# Altium schematic sheet Core_Board_FPGA_STM32.SchDoc
size A0
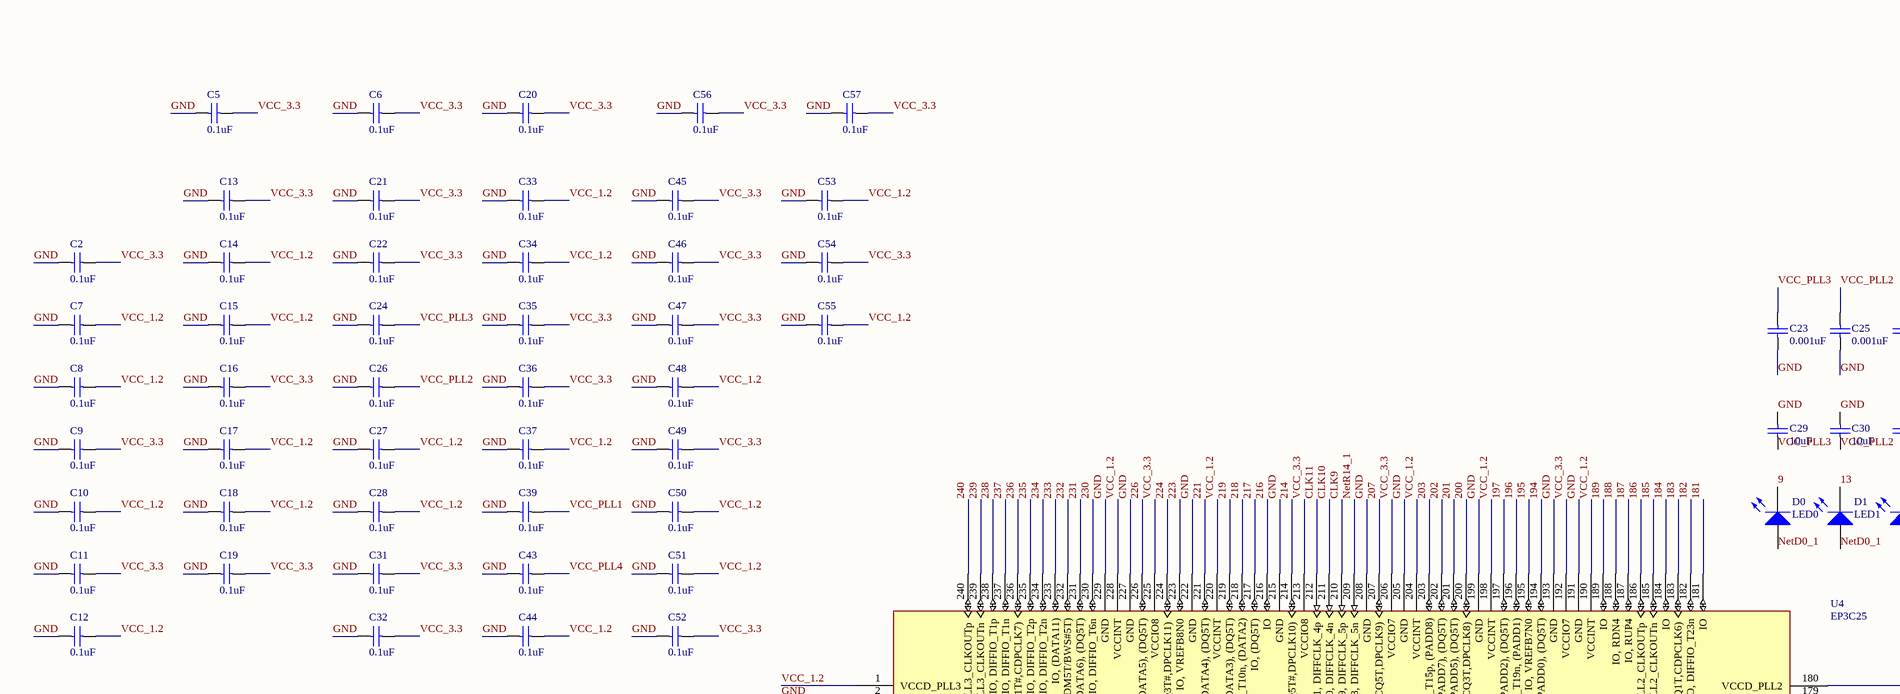
[diagram p0: Core_Board_FPGA_STM32.SchDoc, top left]
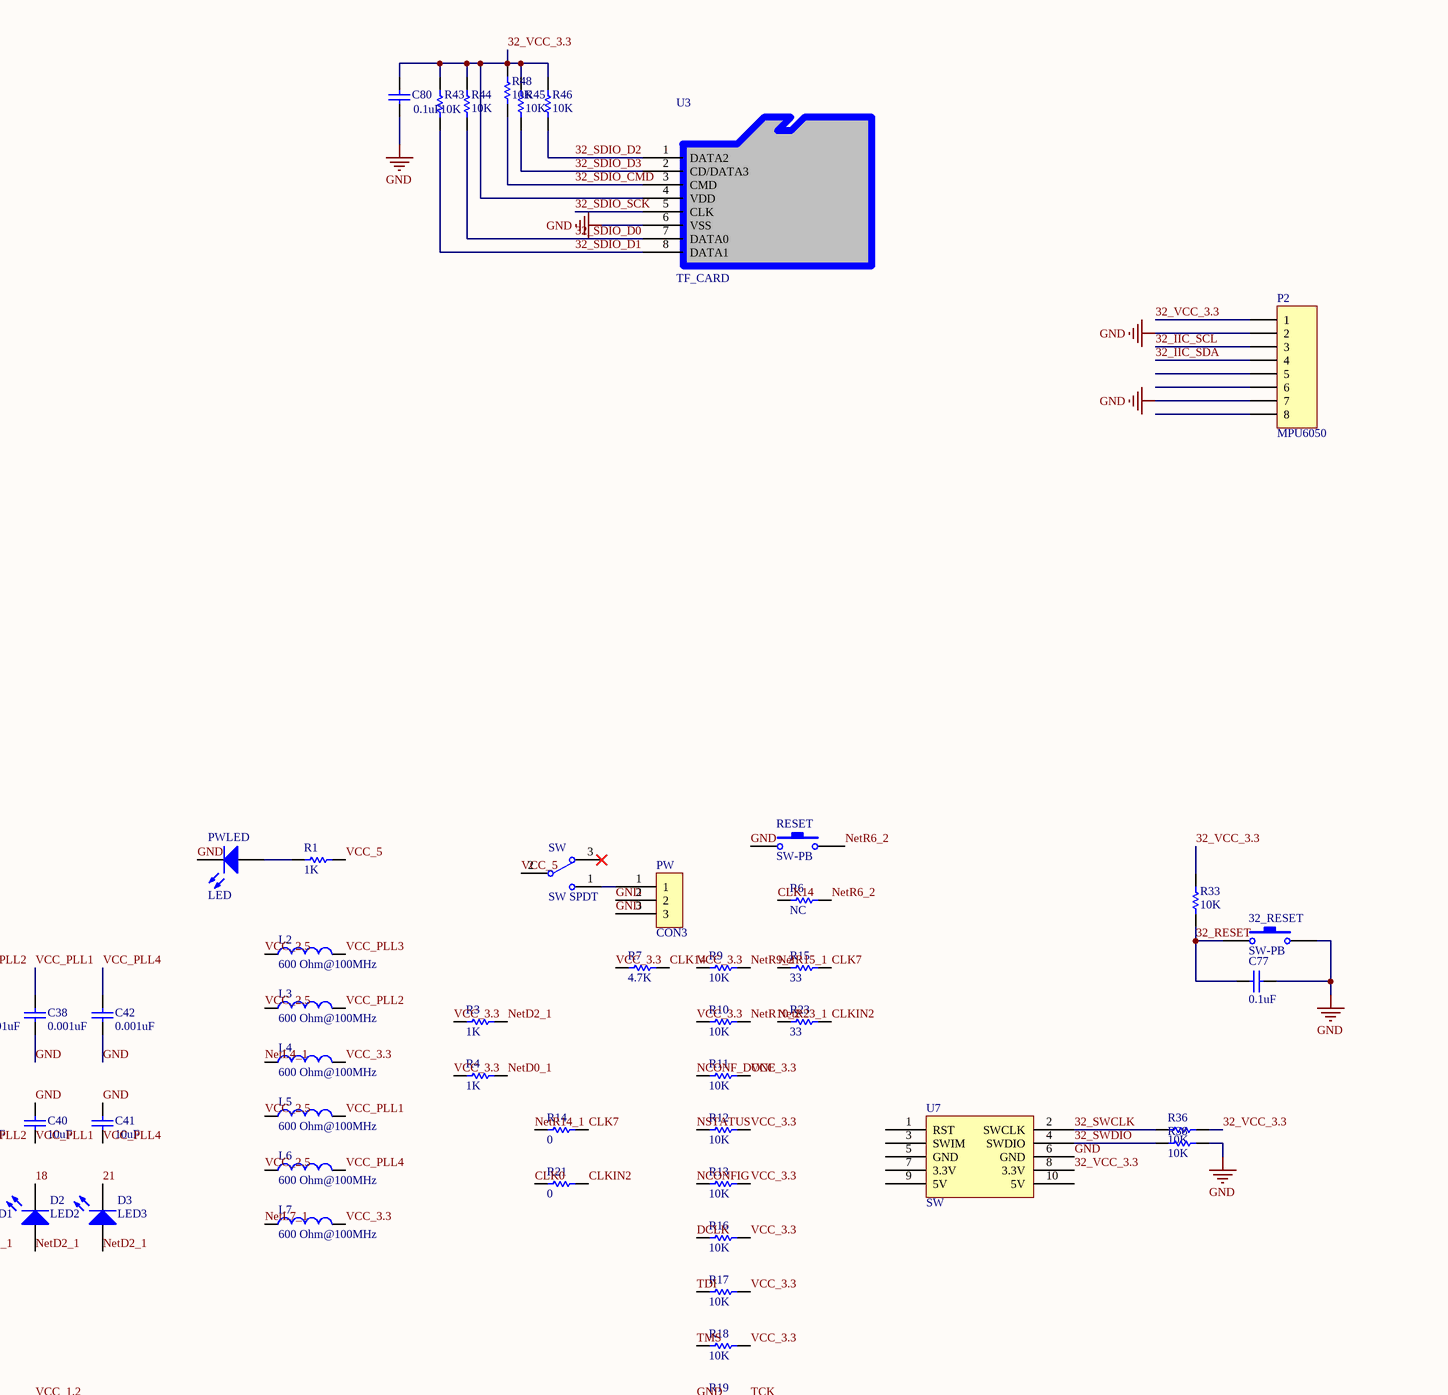
[diagram p1: Core_Board_FPGA_STM32.SchDoc, top middle]
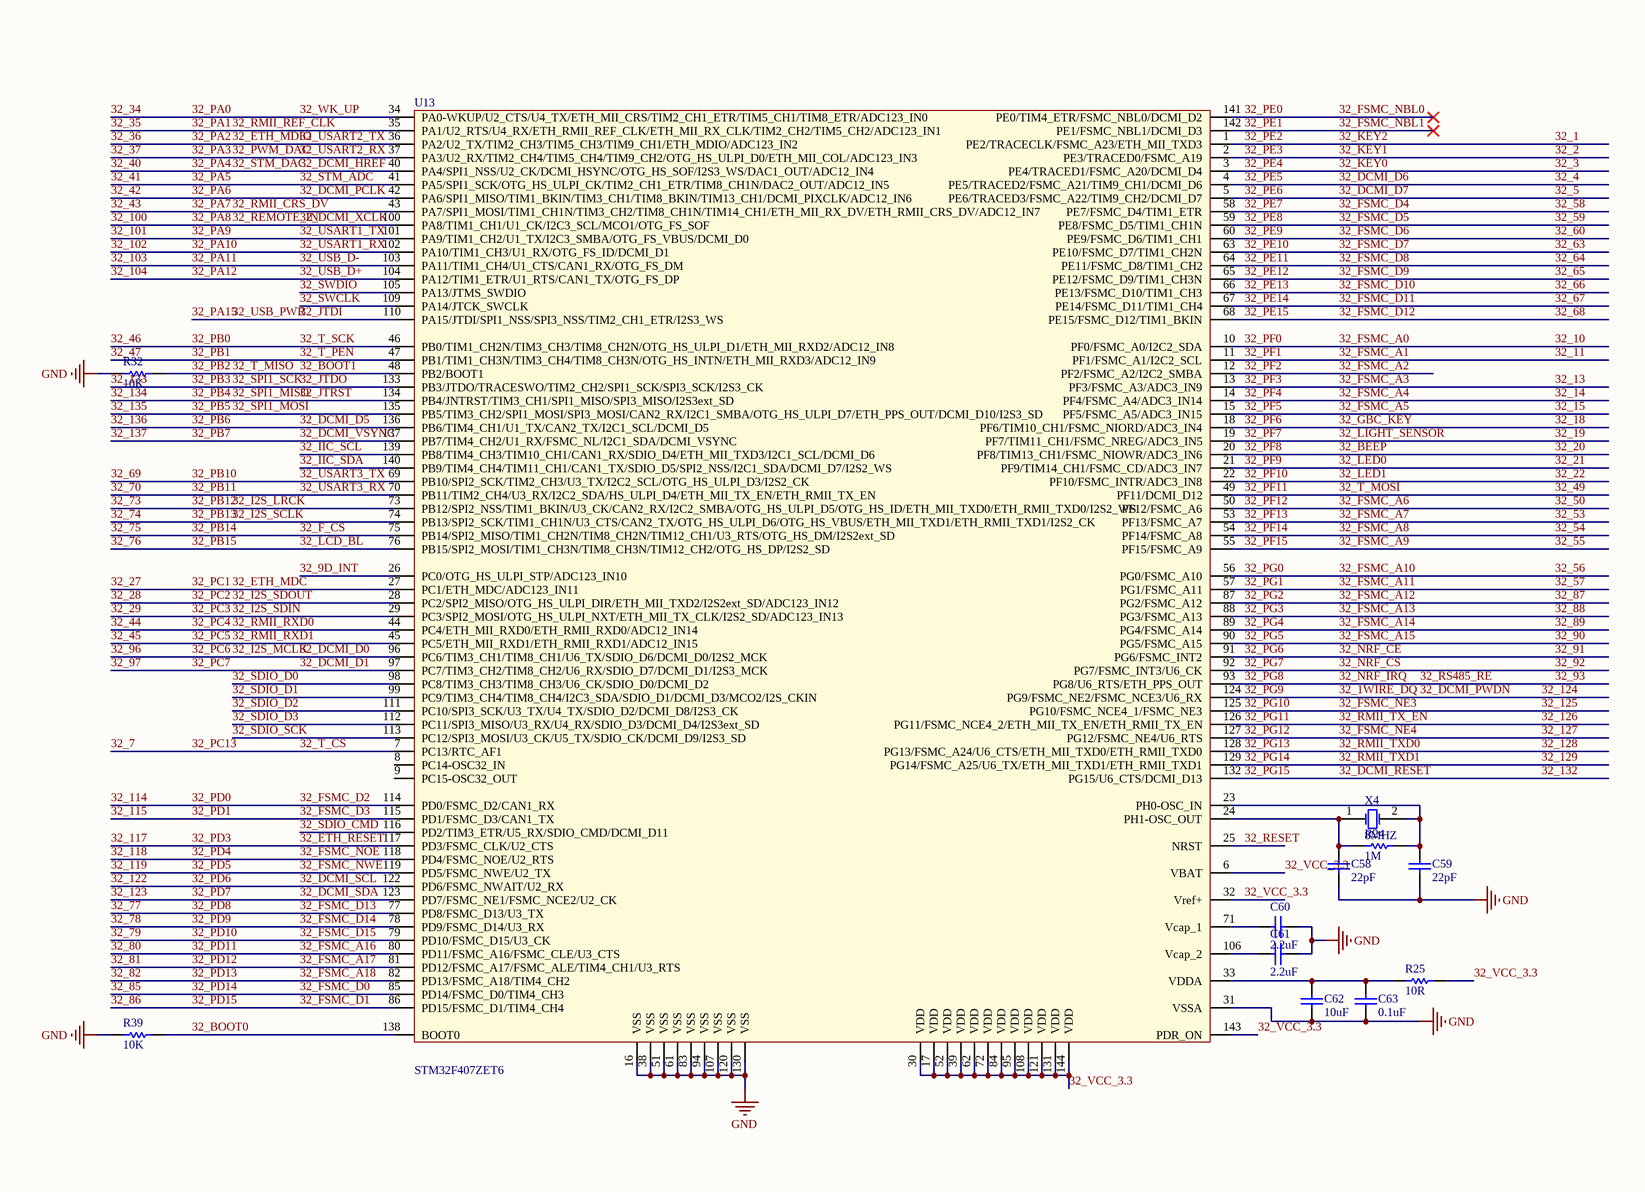
[diagram p2: Core_Board_FPGA_STM32.SchDoc, top right]
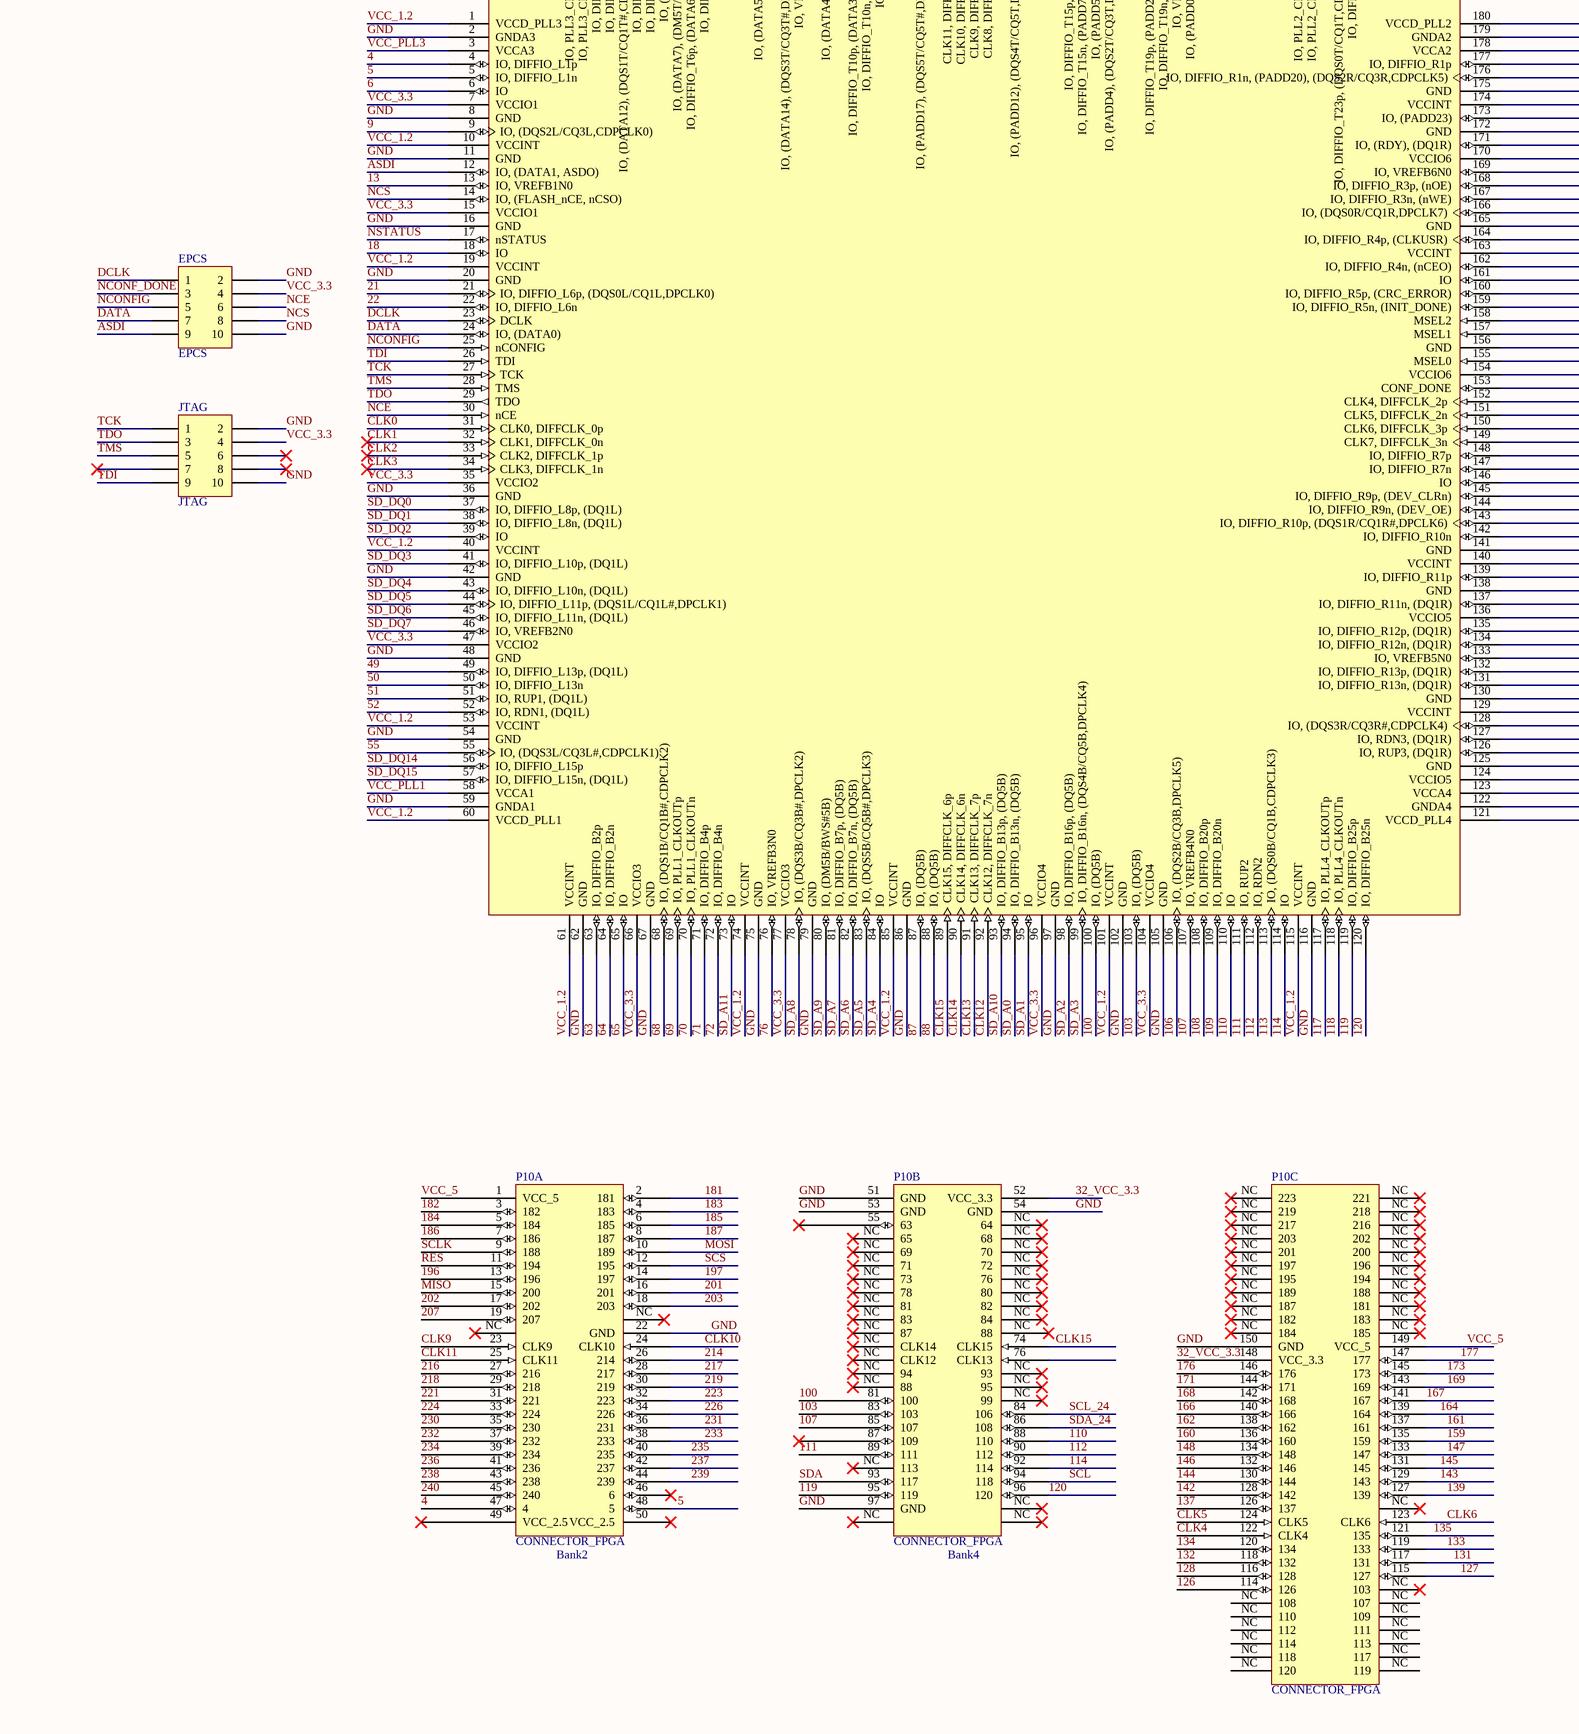
[diagram p3: Core_Board_FPGA_STM32.SchDoc, bottom left]
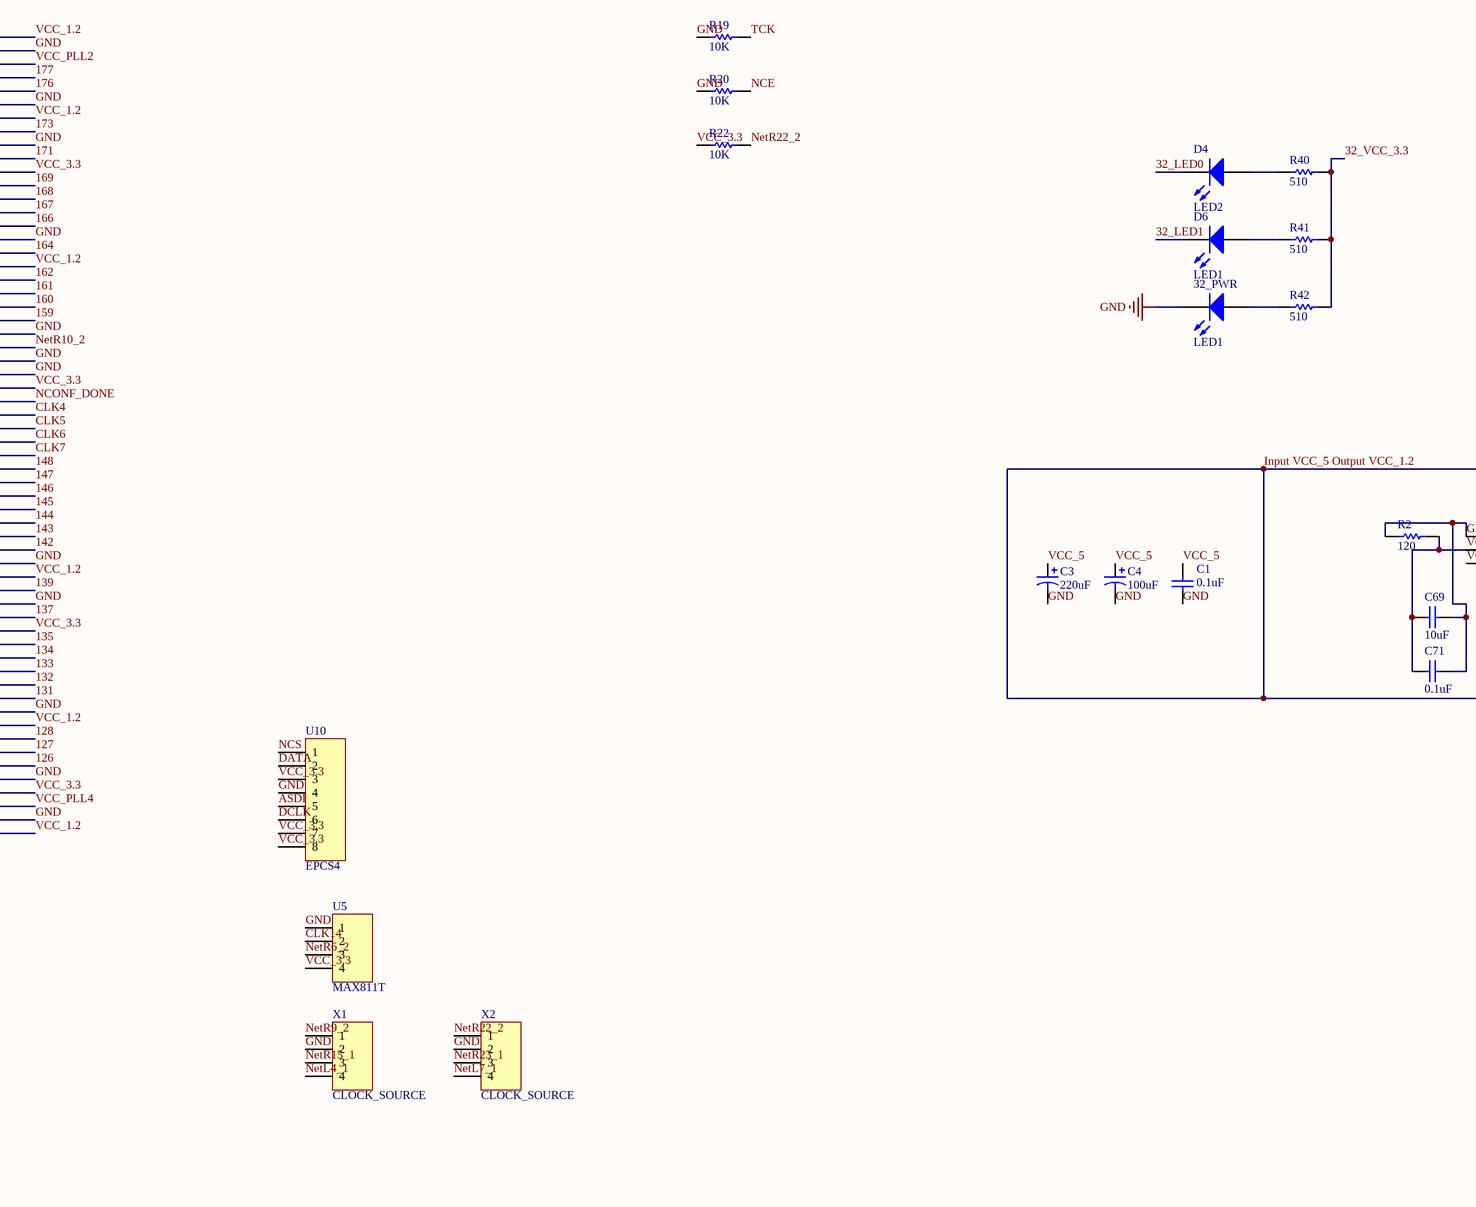
[diagram p4: Core_Board_FPGA_STM32.SchDoc, bottom middle]
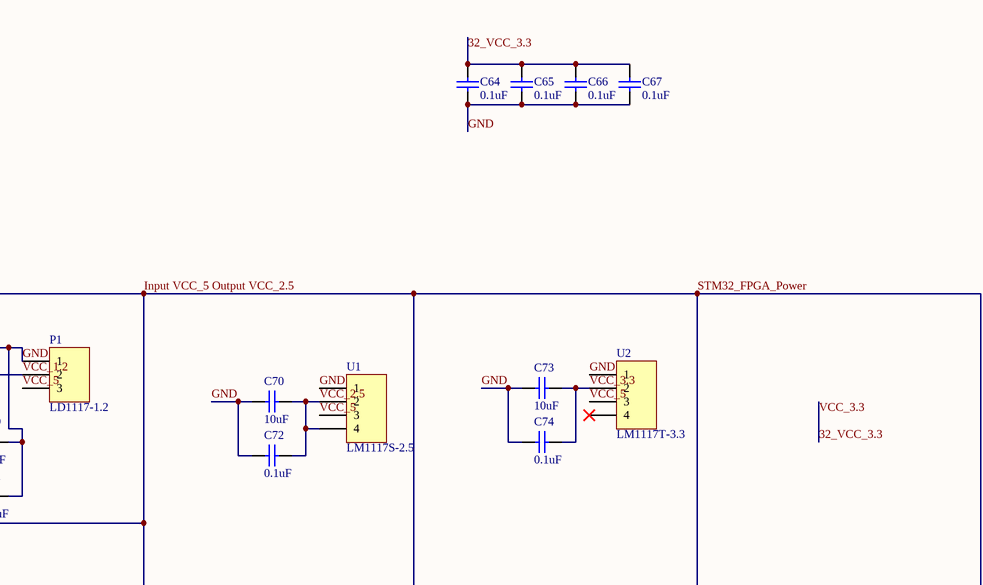
[diagram p5: Core_Board_FPGA_STM32.SchDoc, bottom right]

## Parts
32_PWR  LED1  [0805D]
32_RESET  SW-PB  [SMD_SWITH]
C1  0.1uF  [0805C]
C2  0.1uF  [0805C]
C3  220uF  [Cap6.6*6.6]
C4  100uF  [Cap6.6*6.6]
C5  0.1uF  [0805C]
C6  0.1uF  [0805C]
C7  0.1uF  [0805C]
C8  0.1uF  [0805C]
C9  0.1uF  [0805C]
C10  0.1uF  [0805C]
C11  0.1uF  [0805C]
C12  0.1uF  [0805C]
C13  0.1uF  [0805C]
C14  0.1uF  [0805C]
C15  0.1uF  [0805C]
C16  0.1uF  [0805C]
C17  0.1uF  [0805C]
C18  0.1uF  [0805C]
C19  0.1uF  [0805C]
C20  0.1uF  [0805C]
C21  0.1uF  [0805C]
C22  0.1uF  [0805C]
C23  0.001uF  [0805C]
C24  0.1uF  [0805C]
C25  0.001uF  [0805C]
C26  0.1uF  [0805C]
C27  0.1uF  [0805C]
C28  0.1uF  [0805C]
C29  10uF  [0805C]
C30  10uF  [0805C]
C31  0.1uF  [0805C]
C32  0.1uF  [0805C]
C33  0.1uF  [0805C]
C34  0.1uF  [0805C]
C35  0.1uF  [0805C]
C36  0.1uF  [0805C]
C37  0.1uF  [0805C]
C38  0.001uF  [0805C]
C39  0.1uF  [0805C]
C40  10uF  [0805C]
C41  10uF  [0805C]
C42  0.001uF  [0805C]
C43  0.1uF  [0805C]
C44  0.1uF  [0805C]
C45  0.1uF  [0805C]
C46  0.1uF  [0805C]
C47  0.1uF  [0805C]
C48  0.1uF  [0805C]
C49  0.1uF  [0805C]
C50  0.1uF  [0805C]
C51  0.1uF  [0805C]
C52  0.1uF  [0805C]
C53  0.1uF  [0805C]
C54  0.1uF  [0805C]
C55  0.1uF  [0805C]
C56  0.1uF  [0805C]
C57  0.1uF  [0805C]
C58  22pF  [0805C]
C59  22pF  [0805C]
C60  2.2uF  [0805C]
C61  2.2uF  [0805C]
C62  10uF  [0805C]
C63  0.1uF  [0805C]
C64  0.1uF  [0805C]
C65  0.1uF  [0805C]
C66  0.1uF  [0805C]
C67  0.1uF  [0805C]
C69  10uF  [0805C]
C70  10uF  [0805C]
C71  0.1uF  [0805C]
C72  0.1uF  [0805C]
C73  10uF  [0805C]
C74  0.1uF  [0805C]
C77  0.1uF  [0805C]
C80  0.1uF  [0805C]
D0  LED0  [0805D]
D1  LED1  [0805D]
D2  LED2  [0805D]
D3  LED3  [0805D]
D4  LED2  [0805D]
D6  LED1  [0805D]
EPCS  EPCS  [IDC10_S]
JTAG  JTAG  [IDC10_S]
L2  600 Ohm@100MHz  [0805R]
L3  600 Ohm@100MHz  [0805R]
L4  600 Ohm@100MHz  [0805R]
L5  600 Ohm@100MHz  [0805R]
L6  600 Ohm@100MHz  [0805R]
L7  600 Ohm@100MHz  [0805R]
P1  LD1117-1.2  [TO-252]
P2  MPU6050  [HDR1X8]
P10  CONNECTOR_FPGA  [CONNECTOR_FPGA]  (parts A,B,C of 3)
PW  CON3  [PW_PORT]
PWLED  LED  [0805D]
R1  1K  [0805R]
R2  120  [0805R]
R3  1K  [0805R]
R4  1K  [0805R]
R6  NC  [0805R]
R7  4.7K  [0805R]
R9  10K  [0805R]
R10  10K  [0805R]
R11  10K  [0805R]
R12  10K  [0805R]
R13  10K  [0805R]
R14  0  [0805R]
R15  33  [0805R]
R16  10K  [0805R]
R17  10K  [0805R]
R18  10K  [0805R]
R19  10K  [0805R]
R20  10K  [0805R]
R21  0  [0805R]
R22  10K  [0805R]
R23  33  [0805R]
R24  1M  [0805R]
R25  10R  [0805R]
R32  10K  [0805R]
R33  10K  [0805R]
R36  10K  [0805R]
R38  10K  [0805R]
R39  10K  [0805R]
R40  510  [0805R]
R41  510  [0805R]
R42  510  [0805R]
R43  10K  [1608[0603R]]
R44  10K  [1608[0603R]]
R45  10K  [1608[0603R]]
R46  10K  [1608[0603R]]
R48  10K  [1608[0603R]]
RESET  SW-PB  [SMD_SWITH]
SW  SW SPDT  [PW_SW]
U1  LM1117S-2.5  [SOT-223]
U2  LM1117T-3.3  [TO-252]
U3  TF_CARD  [TF-2]
U4  EP3C25  [PQFP240]
U5  MAX811T  [SOT143]
U7  SW  [SW_PORT]
U10  EPCS4  [SO-G8]
U13  STM32F407ZET6  [LQFP144]
X1  CLOCK_SOURCE  [CRYSTAL4]
X2  CLOCK_SOURCE  [CRYSTAL4]
X4  8MHZ  [5032]

## Nets
GND: 32_PWR.2(K) 32_RESET.2 C1.1 C2.1 C3.2 C4.2 C5.1 C6.1 C7.1 C8.1 C9.1 C10.1 C11.1 C12.1 C13.1 C14.1 C15.1 C16.1 C17.1 C18.1 C19.1 C20.1 C21.1 C22.1 C23.1 C24.1 C25.1 C26.1 C27.1 C28.1 C29.2 C30.2 C31.1 C32.1 C33.1 C34.1 C35.1 C36.1 C37.1 C38.1 C39.1 C40.2 C41.2 C42.1 C43.1 C44.1 C45.1 C46.1 C47.1 C48.1 C49.1 C50.1 C51.1 C52.1 C53.1 C54.1 C55.1 C56.1 C57.1 C58.1 C59.1 C60.2 C61.2 C62.1 C63.1 C64.1 C65.1 C66.1 C67.1 C69.1 C70.1 C71.1 C72.2 C73.1 C74.2 C77.1 C80.1 EPCS.2 EPCS.10 JTAG.2 JTAG.10 P1.1 P2.2 P2.7 P10.22(GND) P10.51(GND) P10.53(GND) P10.54(GND) P10.97(GND) P10.150(GND) PW.2 PW.3 PWLED.2(K) R2.1 R19.1 R20.1 R32.2 R38.1 R39.2 RESET.1 U1.1 U2.1 U3.6(VSS) U4.2(GNDA3) U4.8(GND) U4.11(GND) U4.16(GND) U4.20(GND) U4.36(GND) U4.42(GND) U4.48(GND) U4.54(GND) U4.59(GNDA1) U4.62(GND) U4.67(GND) U4.75(GND) U4.79(GND) U4.86(GND) U4.97(GND) U4.102(GND) U4.105(GND) U4.116(GND) U4.122(GNDA4) U4.125(GND) U4.130(GND) U4.138(GND) U4.141(GND) U4.155(MSEL0) U4.156(GND) U4.158(MSEL2) U4.165(GND) U4.172(GND) U4.175(GND) U4.179(GNDA2) U4.191(GND) U4.193(GND) U4.199(GND) U4.205(GND) U4.208(GND) U4.215(GND) U4.222(GND) U4.227(GND) U4.229(GND) U5.1 U7.6(GND) U10.4 U13.16(VSS) U13.31(VSSA) U13.38(VSS) U13.51(VSS) U13.61(VSS) U13.83(VSS) U13.94(VSS) U13.107(VSS) U13.120(VSS) U13.130(VSS) X1.2 X2.2
4: P10.47(4) U4.4(IO,_DIFFIO_L1p)
5: P10.48(5) U4.5(IO,_DIFFIO_L1n)
6: U4.6(IO)
9: D0.2(K) U4.9(IO,_(DQS2L/CQ3L,CDPCLK0))
13: D1.2(K) U4.13(IO,_VREFB1N0)
18: D2.2(K) U4.18(IO)
21: D3.2(K) U4.21(IO,_DIFFIO_L6p,_(DQS0L/CQ1L,DPCLK0))
22: U4.22(IO,_DIFFIO_L6n)
32_1: U13.1(PE2/TRACECLK/FSMC_A23/ETH_MII_TXD3)  [also labelled 32_KEY2, 32_PE2]
32_2: U13.2(PE3/TRACED0/FSMC_A19)  [also labelled 32_KEY1, 32_PE3]
32_3: U13.3(PE4/TRACED1/FSMC_A20/DCMI_D4)  [also labelled 32_KEY0, 32_PE4]
32_4: U13.4(PE5/TRACED2/FSMC_A21/TIM9_CH1/DCMI_D6)  [also labelled 32_DCMI_D6, 32_PE5]
32_5: U13.5(PE6/TRACED3/FSMC_A22/TIM9_CH2/DCMI_D7)  [also labelled 32_DCMI_D7, 32_PE6]
32_7: U13.7(PC13/RTC_AF1)  [also labelled 32_PC13, 32_T_CS]
32_9D_INT: U13.26(PC0/OTG_HS_ULPI_STP/ADC123_IN10)
32_10: U13.10(PF0/FSMC_A0/I2C2_SDA)  [also labelled 32_FSMC_A0, 32_PF0]
32_11: U13.11(PF1/FSMC_A1/I2C2_SCL)  [also labelled 32_FSMC_A1, 32_PF1]
32_13: U13.13(PF3/FSMC_A3/ADC3_IN9)  [also labelled 32_FSMC_A3, 32_PF3]
32_14: U13.14(PF4/FSMC_A4/ADC3_IN14)  [also labelled 32_FSMC_A4, 32_PF4]
32_15: U13.15(PF5/FSMC_A5/ADC3_IN15)  [also labelled 32_FSMC_A5, 32_PF5]
32_18: U13.18(PF6/TIM10_CH1/FSMC_NIORD/ADC3_IN4)  [also labelled 32_GBC_KEY, 32_PF6]
32_19: U13.19(PF7/TIM11_CH1/FSMC_NREG/ADC3_IN5)  [also labelled 32_LIGHT_SENSOR, 32_PF7]
32_20: U13.20(PF8/TIM13_CH1/FSMC_NIOWR/ADC3_IN6)  [also labelled 32_BEEP, 32_PF8]
32_21: D4.2(K) U13.21(PF9/TIM14_CH1/FSMC_CD/ADC3_IN7)  [also labelled 32_LED0, 32_PF9]
32_22: D6.2(K) U13.22(PF10/FSMC_INTR/ADC3_IN8)  [also labelled 32_LED1, 32_PF10]
32_27: U13.27(PC1/ETH_MDC/ADC123_IN11)  [also labelled 32_ETH_MDC, 32_PC1]
32_28: U13.28(PC2/SPI2_MISO/OTG_HS_ULPI_DIR/ETH_MII_TXD2/I2S2ext_SD/ADC123_IN12)  [also labelled 32_I2S_SDOUT, 32_PC2]
32_29: U13.29(PC3/SPI2_MOSI/OTG_HS_ULPI_NXT/ETH_MII_TX_CLK/I2S2_SD/ADC123_IN13)  [also labelled 32_I2S_SDIN, 32_PC3]
32_34: U13.34(PA0-WKUP/U2_CTS/U4_TX/ETH_MII_CRS/TIM2_CH1_ETR/TIM5_CH1/TIM8_ETR/ADC123_IN0)  [also labelled 32_PA0, 32_WK_UP]
32_35: U13.35(PA1/U2_RTS/U4_RX/ETH_RMII_REF_CLK/ETH_MII_RX_CLK/TIM2_CH2/TIM5_CH2/ADC123_IN1)  [also labelled 32_PA1, 32_RMII_REF_CLK]
32_36: U13.36(PA2/U2_TX/TIM2_CH3/TIM5_CH3/TIM9_CH1/ETH_MDIO/ADC123_IN2)  [also labelled 32_ETH_MDIO, 32_PA2, 32_USART2_TX]
32_37: U13.37(PA3/U2_RX/TIM2_CH4/TIM5_CH4/TIM9_CH2/OTG_HS_ULPI_D0/ETH_MII_COL/ADC123_IN3)  [also labelled 32_PA3, 32_PWM_DAC, 32_USART2_RX]
32_40: U13.40(PA4/SPI1_NSS/U2_CK/DCMI_HSYNC/OTG_HS_SOF/I2S3_WS/DAC1_OUT/ADC12_IN4)  [also labelled 32_DCMI_HREF, 32_PA4, 32_STM_DAC]
32_41: U13.41(PA5/SPI1_SCK/OTG_HS_ULPI_CK/TIM2_CH1_ETR/TIM8_CH1N/DAC2_OUT/ADC12_IN5)  [also labelled 32_PA5, 32_STM_ADC]
32_42: U13.42(PA6/SPI1_MISO/TIM1_BKIN/TIM3_CH1/TIM8_BKIN/TIM13_CH1/DCMI_PIXCLK/ADC12_IN6)  [also labelled 32_DCMI_PCLK, 32_PA6]
32_43: U13.43(PA7/SPI1_MOSI/TIM1_CH1N/TIM3_CH2/TIM8_CH1N/TIM14_CH1/ETH_MII_RX_DV/ETH_RMII_CRS_DV/ADC12_IN7)  [also labelled 32_PA7, 32_RMII_CRS_DV]
32_44: U13.44(PC4/ETH_MII_RXD0/ETH_RMII_RXD0/ADC12_IN14)  [also labelled 32_PC4, 32_RMII_RXD0]
32_45: U13.45(PC5/ETH_MII_RXD1/ETH_RMII_RXD1/ADC12_IN15)  [also labelled 32_PC5, 32_RMII_RXD1]
32_46: U13.46(PB0/TIM1_CH2N/TIM3_CH3/TIM8_CH2N/OTG_HS_ULPI_D1/ETH_MII_RXD2/ADC12_IN8)  [also labelled 32_PB0, 32_T_SCK]
32_47: U13.47(PB1/TIM1_CH3N/TIM3_CH4/TIM8_CH3N/OTG_HS_INTN/ETH_MII_RXD3/ADC12_IN9)  [also labelled 32_PB1, 32_T_PEN]
32_49: U13.49(PF11/DCMI_D12)  [also labelled 32_PF11, 32_T_MOSI]
32_50: U13.50(PF12/FSMC_A6)  [also labelled 32_FSMC_A6, 32_PF12]
32_53: U13.53(PF13/FSMC_A7)  [also labelled 32_FSMC_A7, 32_PF13]
32_54: U13.54(PF14/FSMC_A8)  [also labelled 32_FSMC_A8, 32_PF14]
32_55: U13.55(PF15/FSMC_A9)  [also labelled 32_FSMC_A9, 32_PF15]
32_56: U13.56(PG0/FSMC_A10)  [also labelled 32_FSMC_A10, 32_PG0]
32_57: U13.57(PG1/FSMC_A11)  [also labelled 32_FSMC_A11, 32_PG1]
32_58: U13.58(PE7/FSMC_D4/TIM1_ETR)  [also labelled 32_FSMC_D4, 32_PE7]
32_59: U13.59(PE8/FSMC_D5/TIM1_CH1N)  [also labelled 32_FSMC_D5, 32_PE8]
32_60: U13.60(PE9/FSMC_D6/TIM1_CH1)  [also labelled 32_FSMC_D6, 32_PE9]
32_63: U13.63(PE10/FSMC_D7/TIM1_CH2N)  [also labelled 32_FSMC_D7, 32_PE10]
32_64: U13.64(PE11/FSMC_D8/TIM1_CH2)  [also labelled 32_FSMC_D8, 32_PE11]
32_65: U13.65(PE12/FSMC_D9/TIM1_CH3N)  [also labelled 32_FSMC_D9, 32_PE12]
32_66: U13.66(PE13/FSMC_D10/TIM1_CH3)  [also labelled 32_FSMC_D10, 32_PE13]
32_67: U13.67(PE14/FSMC_D11/TIM1_CH4)  [also labelled 32_FSMC_D11, 32_PE14]
32_68: U13.68(PE15/FSMC_D12/TIM1_BKIN)  [also labelled 32_FSMC_D12, 32_PE15]
32_69: U13.69(PB10/SPI2_SCK/TIM2_CH3/U3_TX/I2C2_SCL/OTG_HS_ULPI_D3/I2S2_CK)  [also labelled 32_PB10, 32_USART3_TX]
32_70: U13.70(PB11/TIM2_CH4/U3_RX/I2C2_SDA/HS_ULPI_D4/ETH_MII_TX_EN/ETH_RMII_TX_EN)  [also labelled 32_PB11, 32_USART3_RX]
32_73: U13.73(PB12/SPI2_NSS/TIM1_BKIN/U3_CK/CAN2_RX/I2C2_SMBA/OTG_HS_ULPI_D5/OTG_HS_ID/ETH_MII_TXD0/ETH_RMII_TXD0/I2S2_WS)  [also labelled 32_I2S_LRCK, 32_PB12]
32_74: U13.74(PB13/SPI2_SCK/TIM1_CH1N/U3_CTS/CAN2_TX/OTG_HS_ULPI_D6/OTG_HS_VBUS/ETH_MII_TXD1/ETH_RMII_TXD1/I2S2_CK)  [also labelled 32_I2S_SCLK, 32_PB13]
32_75: U13.75(PB14/SPI2_MISO/TIM1_CH2N/TIM8_CH2N/TIM12_CH1/U3_RTS/OTG_HS_DM/I2S2ext_SD)  [also labelled 32_F_CS, 32_PB14]
32_76: U13.76(PB15/SPI2_MOSI/TIM1_CH3N/TIM8_CH3N/TIM12_CH2/OTG_HS_DP/I2S2_SD)  [also labelled 32_LCD_BL, 32_PB15]
32_77: U13.77(PD8/FSMC_D13/U3_TX)  [also labelled 32_FSMC_D13, 32_PD8]
32_78: U13.78(PD9/FSMC_D14/U3_RX)  [also labelled 32_FSMC_D14, 32_PD9]
32_79: U13.79(PD10/FSMC_D15/U3_CK)  [also labelled 32_FSMC_D15, 32_PD10]
32_80: U13.80(PD11/FSMC_A16/FSMC_CLE/U3_CTS)  [also labelled 32_FSMC_A16, 32_PD11]
32_81: U13.81(PD12/FSMC_A17/FSMC_ALE/TIM4_CH1/U3_RTS)  [also labelled 32_FSMC_A17, 32_PD12]
32_82: U13.82(PD13/FSMC_A18/TIM4_CH2)  [also labelled 32_FSMC_A18, 32_PD13]
32_85: U13.85(PD14/FSMC_D0/TIM4_CH3)  [also labelled 32_FSMC_D0, 32_PD14]
32_86: U13.86(PD15/FSMC_D1/TIM4_CH4)  [also labelled 32_FSMC_D1, 32_PD15]
32_87: U13.87(PG2/FSMC_A12)  [also labelled 32_FSMC_A12, 32_PG2]
32_88: U13.88(PG3/FSMC_A13)  [also labelled 32_FSMC_A13, 32_PG3]
32_89: U13.89(PG4/FSMC_A14)  [also labelled 32_FSMC_A14, 32_PG4]
32_90: U13.90(PG5/FSMC_A15)  [also labelled 32_FSMC_A15, 32_PG5]
32_91: U13.91(PG6/FSMC_INT2)  [also labelled 32_NRF_CE, 32_PG6]
32_92: U13.92(PG7/FSMC_INT3/U6_CK)  [also labelled 32_NRF_CS, 32_PG7]
32_93: U13.93(PG8/U6_RTS/ETH_PPS_OUT)  [also labelled 32_NRF_IRQ, 32_PG8, 32_RS485_RE]
32_96: U13.96(PC6/TIM3_CH1/TIM8_CH1/U6_TX/SDIO_D6/DCMI_D0/I2S2_MCK)  [also labelled 32_DCMI_D0, 32_I2S_MCLK, 32_PC6]
32_97: U13.97(PC7/TIM3_CH2/TIM8_CH2/U6_RX/SDIO_D7/DCMI_D1/I2S3_MCK)  [also labelled 32_DCMI_D1, 32_PC7]
32_100: U13.100(PA8/TIM1_CH1/U1_CK/I2C3_SCL/MCO1/OTG_FS_SOF)  [also labelled 32_DCMI_XCLK, 32_PA8, 32_REMOTE_IN]
32_101: U13.101(PA9/TIM1_CH2/U1_TX/I2C3_SMBA/OTG_FS_VBUS/DCMI_D0)  [also labelled 32_PA9, 32_USART1_TX]
32_102: U13.102(PA10/TIM1_CH3/U1_RX/OTG_FS_ID/DCMI_D1)  [also labelled 32_PA10, 32_USART1_RX]
32_103: U13.103(PA11/TIM1_CH4/U1_CTS/CAN1_RX/OTG_FS_DM)  [also labelled 32_PA11, 32_USB_D-]
32_104: U13.104(PA12/TIM1_ETR/U1_RTS/CAN1_TX/OTG_FS_DP)  [also labelled 32_PA12, 32_USB_D+]
32_114: U13.114(PD0/FSMC_D2/CAN1_RX)  [also labelled 32_FSMC_D2, 32_PD0]
32_115: U13.115(PD1/FSMC_D3/CAN1_TX)  [also labelled 32_FSMC_D3, 32_PD1]
32_117: U13.117(PD3/FSMC_CLK/U2_CTS)  [also labelled 32_ETH_RESET, 32_PD3]
32_118: U13.118(PD4/FSMC_NOE/U2_RTS)  [also labelled 32_FSMC_NOE, 32_PD4]
32_119: U13.119(PD5/FSMC_NWE/U2_TX)  [also labelled 32_FSMC_NWE, 32_PD5]
32_122: U13.122(PD6/FSMC_NWAIT/U2_RX)  [also labelled 32_DCMI_SCL, 32_PD6]
32_123: U13.123(PD7/FSMC_NE1/FSMC_NCE2/U2_CK)  [also labelled 32_DCMI_SDA, 32_PD7]
32_124: U13.124(PG9/FSMC_NE2/FSMC_NCE3/U6_RX)  [also labelled 32_1WIRE_DQ, 32_DCMI_PWDN, 32_PG9]
32_125: U13.125(PG10/FSMC_NCE4_1/FSMC_NE3)  [also labelled 32_FSMC_NE3, 32_PG10]
32_126: U13.126(PG11/FSMC_NCE4_2/ETH_MII_TX_EN/ETH_RMII_TX_EN)  [also labelled 32_PG11, 32_RMII_TX_EN]
32_127: U13.127(PG12/FSMC_NE4/U6_RTS)  [also labelled 32_FSMC_NE4, 32_PG12]
32_128: U13.128(PG13/FSMC_A24/U6_CTS/ETH_MII_TXD0/ETH_RMII_TXD0)  [also labelled 32_PG13, 32_RMII_TXD0]
32_129: U13.129(PG14/FSMC_A25/U6_TX/ETH_MII_TXD1/ETH_RMII_TXD1)  [also labelled 32_PG14, 32_RMII_TXD1]
32_132: U13.132(PG15/U6_CTS/DCMI_D13)  [also labelled 32_DCMI_RESET, 32_PG15]
32_133: U13.133(PB3/JTDO/TRACESWO/TIM2_CH2/SPI1_SCK/SPI3_SCK/I2S3_CK)  [also labelled 32_JTDO, 32_PB3, 32_SPI1_SCK]
32_134: U13.134(PB4/JNTRST/TIM3_CH1/SPI1_MISO/SPI3_MISO/I2S3ext_SD)  [also labelled 32_JTRST, 32_PB4, 32_SPI1_MISO]
32_135: U13.135(PB5/TIM3_CH2/SPI1_MOSI/SPI3_MOSI/CAN2_RX/I2C1_SMBA/OTG_HS_ULPI_D7/ETH_PPS_OUT/DCMI_D10/I2S3_SD)  [also labelled 32_PB5, 32_SPI1_MOSI]
32_136: U13.136(PB6/TIM4_CH1/U1_TX/CAN2_TX/I2C1_SCL/DCMI_D5)  [also labelled 32_DCMI_D5, 32_PB6]
32_137: U13.137(PB7/TIM4_CH2/U1_RX/FSMC_NL/I2C1_SDA/DCMI_VSYNC)  [also labelled 32_DCMI_VSYNC, 32_PB7]
32_BOOT0: R39.1 U13.138(BOOT0)
32_BOOT1: R32.1 U13.48(PB2/BOOT1)  [also labelled 32_PB2, 32_T_MISO]
32_FSMC_A2: U13.12(PF2/FSMC_A2/I2C2_SMBA)  [also labelled 32_PF2]
32_FSMC_NBL0: U13.141(PE0/TIM4_ETR/FSMC_NBL0/DCMI_D2)  [also labelled 32_PE0]
32_FSMC_NBL1: U13.142(PE1/FSMC_NBL1/DCMI_D3)  [also labelled 32_PE1]
32_IIC_SCL: P2.3 U13.139(PB8/TIM4_CH3/TIM10_CH1/CAN1_RX/SDIO_D4/ETH_MII_TXD3/I2C1_SCL/DCMI_D6)
32_IIC_SDA: P2.4 U13.140(PB9/TIM4_CH4/TIM11_CH1/CAN1_TX/SDIO_D5/SPI2_NSS/I2C1_SDA/DCMI_D7/I2S2_WS)
32_JTDI: U13.110(PA15/JTDI/SPI1_NSS/SPI3_NSS/TIM2_CH1_ETR/I2S3_WS)  [also labelled 32_PA15, 32_USB_PWR]
32_RESET: 32_RESET.1 C77.2 R33.1 U13.25(NRST)
32_SDIO_CMD: R48.2 U3.3(CMD) U13.116(PD2/TIM3_ETR/U5_RX/SDIO_CMD/DCMI_D11)
32_SDIO_D0: R44.2 U3.7(DATA0) U13.98(PC8/TIM3_CH3/TIM8_CH3/U6_CK/SDIO_D0/DCMI_D2)
32_SDIO_D1: R43.2 U3.8(DATA1) U13.99(PC9/TIM3_CH4/TIM8_CH4/I2C3_SDA/SDIO_D1/DCMI_D3/MCO2/I2S_CKIN)
32_SDIO_D2: R46.2 U3.1(DATA2) U13.111(PC10/SPI3_SCK/U3_TX/U4_TX/SDIO_D2/DCMI_D8/I2S3_CK)
32_SDIO_D3: R45.2 U3.2(CD/DATA3) U13.112(PC11/SPI3_MISO/U3_RX/U4_RX/SDIO_D3/DCMI_D4/I2S3ext_SD)
32_SDIO_SCK: U3.5(CLK) U13.113(PC12/SPI3_MOSI/U3_CK/U5_TX/SDIO_CK/DCMI_D9/I2S3_SD)
32_SWCLK: R36.1 U7.2(SWCLK) U13.109(PA14/JTCK_SWCLK)
32_SWDIO: R38.2 U7.4(SWDIO) U13.105(PA13/JTMS_SWDIO)
32_VCC_3.3: C2.2 C5.2 C6.2 C9.2 C11.2 C13.2 C16.2 C19.2 C20.2 C21.2 C22.2 C31.2 C32.2 C35.2 C36.2 C45.2 C46.2 C47.2 C49.2 C52.2 C54.2 C56.2 C57.2 C64.2 C65.2 C66.2 C67.2 C73.2 C74.1 C80.2 EPCS.4 JTAG.4 L4.2 L7.2 P2.1 P10.52(VCC_3.3) P10.148(VCC_3.3) R3.1 R4.1 R7.1 R9.1 R10.1 R11.2 R12.2 R13.2 R16.2 R17.2 R18.2 R22.1 R25.2 R33.2 R36.2 R40.2 R41.2 R42.2 R43.1 R44.1 R45.1 R46.1 R48.1 U2.2 U3.4(VDD) U4.7(VCCIO1) U4.15(VCCIO1) U4.35(VCCIO2) U4.47(VCCIO2) U4.66(VCCIO3) U4.77(VCCIO3) U4.96(VCCIO4) U4.104(VCCIO4) U4.124(VCCIO5) U4.136(VCCIO5) U4.154(VCCIO6) U4.170(VCCIO6) U4.192(VCCIO7) U4.206(VCCIO7) U4.213(VCCIO8) U4.225(VCCIO8) U5.4 U7.8(3.3V) U10.3 U10.7 U10.8 U13.6(VBAT) U13.17(VDD) U13.30(VDD) U13.32(Vref+) U13.39(VDD) U13.52(VDD) U13.62(VDD) U13.72(VDD) U13.84(VDD) U13.95(VDD) U13.108(VDD) U13.121(VDD) U13.131(VDD) U13.143(PDR_ON) U13.144(VDD)  [also labelled VCC_3.3]
49: U4.49(IO,_DIFFIO_L13p,_(DQ1L))
50: U4.50(IO,_DIFFIO_L13n)
51: U4.51(IO,_RUP1,_(DQ1L))
52: U4.52(IO,_RDN1,_(DQ1L))
55: U4.55(IO,_(DQS3L/CQ3L#,CDPCLK1))
63: U4.63(IO,_DIFFIO_B2p)
64: U4.64(IO,_DIFFIO_B2n)
65: U4.65(IO)
68: U4.68(IO,_(DQS1B/CQ1B#,CDPCLK2))
69: U4.69(IO,_PLL1_CLKOUTp)
70: U4.70(IO,_PLL1_CLKOUTn)
71: U4.71(IO,_DIFFIO_B4p)
72: U4.72(IO,_DIFFIO_B4n)
76: U4.76(IO,_VREFB3N0)
87: U4.87(IO,_(DQ5B))
88: U4.88(IO,_(DQ5B))
100: P10.81(100) U4.100(IO,_(DQ5B))
103: P10.83(103) U4.103(IO,_(DQ5B))
106: U4.106(IO,_(DQS2B/CQ3B,DPCLK5))
107: P10.85(107) U4.107(IO,_VREFB4N0)
108: U4.108(IO,_DIFFIO_B20p)
109: U4.109(IO,_DIFFIO_B20n)
110: P10.88(110) U4.110(IO)
111: P10.89(111) U4.111(IO,_RUP2)
112: P10.90(112) U4.112(IO,_RDN2)
113: U4.113(IO,_(DQS0B/CQ1B,CDPCLK3))
114: P10.92(114) U4.114(IO)
117: U4.117(IO,_PLL4_CLKOUTp)
118: U4.118(IO,_PLL4_CLKOUTn)
119: P10.95(119) U4.119(IO,_DIFFIO_B25p)
120: P10.96(120) U4.120(IO,_DIFFIO_B25n)
126: P10.114(126) U4.126(IO,_RUP3,_(DQ1R))
127: P10.115(127) U4.127(IO,_RDN3,_(DQ1R))
128: P10.116(128) U4.128(IO,_(DQS3R/CQ3R#,CDPCLK4))
131: P10.117(131) U4.131(IO,_DIFFIO_R13n,_(DQ1R))
132: P10.118(132) U4.132(IO,_DIFFIO_R13p,_(DQ1R))
133: P10.119(133) U4.133(IO,_VREFB5N0)
134: P10.120(134) U4.134(IO,_DIFFIO_R12n,_(DQ1R))
135: P10.121(135) U4.135(IO,_DIFFIO_R12p,_(DQ1R))
137: P10.126(137) U4.137(IO,_DIFFIO_R11n,_(DQ1R))
139: P10.127(139) U4.139(IO,_DIFFIO_R11p)
142: P10.128(142) U4.142(IO,_DIFFIO_R10n)
143: P10.129(143) U4.143(IO,_DIFFIO_R10p,_(DQS1R/CQ1R#,DPCLK6))
144: P10.130(144) U4.144(IO,_DIFFIO_R9n,_(DEV_OE))
145: P10.131(145) U4.145(IO,_DIFFIO_R9p,_(DEV_CLRn))
146: P10.132(146) U4.146(IO)
147: P10.133(147) U4.147(IO,_DIFFIO_R7n)
148: P10.134(148) U4.148(IO,_DIFFIO_R7p)
159: P10.135(159) U4.159(IO,_DIFFIO_R5n,_(INIT_DONE))
160: P10.136(160) U4.160(IO,_DIFFIO_R5p,_(CRC_ERROR))
161: P10.137(161) U4.161(IO)
162: P10.138(162) U4.162(IO,_DIFFIO_R4n,_(nCEO))
164: P10.139(164) U4.164(IO,_DIFFIO_R4p,_(CLKUSR))
166: P10.140(166) U4.166(IO,_(DQS0R/CQ1R,DPCLK7))
167: P10.141(167) U4.167(IO,_DIFFIO_R3n,_(nWE))
168: P10.142(168) U4.168(IO,_DIFFIO_R3p,_(nOE))
169: P10.143(169) U4.169(IO,_VREFB6N0)
171: P10.144(171) U4.171(IO,_(RDY),_(DQ1R))
173: P10.145(173) U4.173(IO,_(PADD23))
176: P10.146(176) U4.176(IO,_DIFFIO_R1n,_(PADD20),_(DQS2R/CQ3R,CDPCLK5))
177: P10.147(177) U4.177(IO,_DIFFIO_R1p)
181: P10.2(181) U4.181(IO)
182: P10.3(182) U4.182(IO,_DIFFIO_T23n)
183: P10.4(183) U4.183(IO,_DIFFIO_T23p,_(DQS0T/CQ1T,CDPCLK6))
184: P10.5(184) U4.184(IO)
185: P10.6(185) U4.185(IO,_PLL2_CLKOUTn)
186: P10.7(186) U4.186(IO,_PLL2_CLKOUTp)
187: P10.8(187) U4.187(IO,_RUP4)
188: U4.188(IO,_RDN4)
189: U4.189(IO)
194: U4.194(IO,_(PADD0),_(DQ5T))
195: U4.195(IO,_VREFB7N0)
196: P10.13(196) U4.196(IO,_DIFFIO_T19n,_(PADD1))
197: P10.14(197) U4.197(IO,_DIFFIO_T19p,_(PADD2),_(DQ5T))
200: U4.200(IO,_(PADD4),_(DQS2T/CQ3T,DPCLK8))
201: P10.16(201) U4.201(IO,_(PADD5),_(DQ5T))
202: P10.17(202) U4.202(IO,_DIFFIO_T15n,_(PADD7),_(DQ5T))
203: P10.18(203) U4.203(IO,_DIFFIO_T15p,_(PADD8))
207: P10.19(207) U4.207(IO,_(PADD12),_(DQS4T/CQ5T,DPCLK9))
214: P10.26(214) U4.214(IO,_(PADD17),_(DQS5T/CQ5T#,DPCLK10))
216: P10.27(216) U4.216(IO)
217: P10.28(217) U4.217(IO,_(DQ5T))
218: P10.29(218) U4.218(IO,_DIFFIO_T10n,_(DATA2))
219: P10.30(219) U4.219(IO,_DIFFIO_T10p,_(DATA3),_(DQ5T))
221: P10.31(221) U4.221(IO,_(DATA4),_(DQ5T))
223: P10.32(223) U4.223(IO,_VREFB8N0)
224: P10.33(224) U4.224(IO,_(DATA14),_(DQS3T/CQ3T#,DPCLK11))
226: P10.34(226) U4.226(IO,_(DATA5),_(DQ5T))
230: P10.35(230) U4.230(IO,_DIFFIO_T6n)
231: P10.36(231) U4.231(IO,_DIFFIO_T6p,_(DATA6),_(DQ5T))
232: P10.37(232) U4.232(IO,_(DATA7),_(DM5T/BWS#5T))
233: P10.38(233) U4.233(IO,_(DATA11))
234: P10.39(234) U4.234(IO,_DIFFIO_T2n)
235: P10.40(235) U4.235(IO,_DIFFIO_T2p)
236: P10.41(236) U4.236(IO,_(DATA12),_(DQS1T/CQ1T#,CDPCLK7))
237: P10.42(237) U4.237(IO,_DIFFIO_T1n)
238: P10.43(238) U4.238(IO,_DIFFIO_T1p)
239: P10.44(239) U4.239(IO,_PLL3_CLKOUTn)
240: P10.45(240) U4.240(IO,_PLL3_CLKOUTp)
ASDI: EPCS.9 U4.12(IO,_(DATA1,_ASDO)) U10.5
CLK0: R21.1 U4.31(CLK0,_DIFFCLK_0p)
CLK1: U4.32(CLK1,_DIFFCLK_0n)
CLK2: U4.33(CLK2,_DIFFCLK_1p)
CLK3: U4.34(CLK3,_DIFFCLK_1n)
CLK4: P10.122(CLK4) U4.152(CLK4,_DIFFCLK_2p)
CLK5: P10.124(CLK5) U4.151(CLK5,_DIFFCLK_2n)
CLK6: P10.123(CLK6) U4.150(CLK6,_DIFFCLK_3p)
CLK7: R14.2 R15.2 U4.149(CLK7,_DIFFCLK_3n)
CLK9: P10.23(CLK9) U4.210(CLK9,_DIFFCLK_5p)
CLK10: P10.24(CLK10) U4.211(CLK10,_DIFFCLK_4n)
CLK11: P10.25(CLK11) U4.212(CLK11,_DIFFCLK_4p)
CLK12: U4.92(CLK12,_DIFFCLK_7n)
CLK13: U4.91(CLK13,_DIFFCLK_7p)
CLK14: R6.1 R7.2 U4.90(CLK14,_DIFFCLK_6n) U5.2
CLK15: P10.74(CLK15) U4.89(CLK15,_DIFFCLK_6p)
CLKIN2: R21.2 R23.2
DATA: EPCS.7 U4.24(IO,_(DATA0)) U10.2
DCLK: EPCS.1 R16.1 U4.23(DCLK) U10.6
MISO: P10.15(200)
MOSI: P10.10(189)
NCE: EPCS.6 R20.2 U4.30(nCE)
NCONF_DONE: EPCS.3 R11.1 U4.153(CONF_DONE)
NCONFIG: EPCS.5 R13.1 U4.25(nCONFIG)
NCS: EPCS.8 U4.14(IO,_(FLASH_nCE,_nCSO)) U10.1
NetD0_1: D0.1(A) D1.1(A) R4.2
NetD2_1: D2.1(A) D3.1(A) R3.2
NetL4_1: L4.1 X1.4
NetL7_1: L7.1 X2.4
NetR6_2: R6.2 RESET.2 U5.3
NetR9_2: R9.2 X1.1
NetR10_2: R10.2 U4.157(MSEL1)
NetR14_1: R14.1 U4.209(CLK8,_DIFFCLK_5n)
NetR15_1: R15.1 X1.3
NetR22_2: R22.2 X2.1
NetR23_1: R23.1 X2.3
NSTATUS: R12.1 U4.17(nSTATUS)
RES: P10.11(194)
SCL: P10.94(118)
SCL_24: P10.84(106)
SCLK: P10.9(188)
SCS: P10.12(195)
SD_A0: U4.94(IO,_DIFFIO_B13n,_(DQ5B))
SD_A1: U4.95(IO)
SD_A2: U4.98(IO,_DIFFIO_B16p,_(DQ5B))
SD_A3: U4.99(IO,_DIFFIO_B16n,_(DQS4B/CQ5B,DPCLK4))
SD_A4: U4.84(IO)
SD_A5: U4.83(IO,_(DQS5B/CQ5B#,DPCLK3))
SD_A6: U4.82(IO,_DIFFIO_B7n,_(DQ5B))
SD_A7: U4.81(IO,_DIFFIO_B7p,_(DQ5B))
SD_A8: U4.78(IO,_(DQS3B/CQ3B#,DPCLK2))
SD_A9: U4.80(IO,_(DM5B/BWS#5B))
SD_A10: U4.93(IO,_DIFFIO_B13p,_(DQ5B))
SD_A11: U4.73(IO)
SD_DQ0: U4.37(IO,_DIFFIO_L8p,_(DQ1L))
SD_DQ1: U4.38(IO,_DIFFIO_L8n,_(DQ1L))
SD_DQ2: U4.39(IO)
SD_DQ3: U4.41(IO,_DIFFIO_L10p,_(DQ1L))
SD_DQ4: U4.43(IO,_DIFFIO_L10n,_(DQ1L))
SD_DQ5: U4.44(IO,_DIFFIO_L11p,_(DQS1L/CQ1L#,DPCLK1))
SD_DQ6: U4.45(IO,_DIFFIO_L11n,_(DQ1L))
SD_DQ7: U4.46(IO,_VREFB2N0)
SD_DQ14: U4.56(IO,_DIFFIO_L15p)
SD_DQ15: U4.57(IO,_DIFFIO_L15n,_(DQ1L))
SDA: P10.93(117)
SDA_24: P10.86(108)
TCK: JTAG.1 R19.2 U4.27(TCK)
TDI: JTAG.9 R17.1 U4.26(TDI)
TDO: JTAG.3 U4.29(TDO)
TMS: JTAG.5 R18.1 U4.28(TMS)
VCC_1.2: C7.2 C8.2 C10.2 C12.2 C14.2 C15.2 C17.2 C18.2 C27.2 C28.2 C33.2 C34.2 C37.2 C44.2 C48.2 C50.2 C51.2 C53.2 C55.2 C69.2 C71.2 P1.2 R2.2 U4.1(VCCD_PLL3) U4.10(VCCINT) U4.19(VCCINT) U4.40(VCCINT) U4.53(VCCINT) U4.60(VCCD_PLL1) U4.61(VCCINT) U4.74(VCCINT) U4.85(VCCINT) U4.101(VCCINT) U4.115(VCCINT) U4.121(VCCD_PLL4) U4.129(VCCINT) U4.140(VCCINT) U4.163(VCCINT) U4.174(VCCINT) U4.180(VCCD_PLL2) U4.190(VCCINT) U4.198(VCCINT) U4.204(VCCINT) U4.220(VCCINT) U4.228(VCCINT)
VCC_2.5: C70.2 C72.1 L2.1 L3.1 L5.1 L6.1 U1.2 U1.4
VCC_5: C1.2 C3.1 C4.1 P1.3 P10.1(VCC_5) P10.149(VCC_5) R1.2 SW.2 U1.3 U2.3
VCC_PLL1: C38.2 C39.2 C40.1 L5.2 U4.58(VCCA1)
VCC_PLL2: C25.2 C26.2 C30.1 L3.2 U4.178(VCCA2)
VCC_PLL3: C23.2 C24.2 C29.1 L2.2 U4.3(VCCA3)
VCC_PLL4: C41.1 C42.2 C43.2 L6.2 U4.123(VCCA4)
Net32_PWR_1: 32_PWR.1(A) R42.1
NetC58_2: C58.2 R24.1 U13.24(PH1-OSC_OUT) X4.1(OSC1)
NetC59_2: C59.2 R24.2 U13.23(PH0-OSC_IN) X4.2(OSC2)
NetC60_1: C60.1 U13.71(Vcap_1)
NetC61_1: C61.1 U13.106(Vcap_2)
NetC62_2: C62.2 C63.2 R25.1 U13.33(VDDA)
NetD4_1: D4.1(A) R40.1
NetD6_1: D6.1(A) R41.1
NetPW_1: PW.1 SW.1
NetPWLED_1: PWLED.1(A) R1.1

Not connected (* = marked no-connect by the designer): JTAG 6* 7* 8*; P2 5 6 8; P10 46(6)* 49(VCC_2.5)* 50(VCC_2.5)* 55(63)* 76(CLK13) 87(109)* NC(103)*; SW 3*; U2 4*; U7 1(RST) 3(SWIM) 5(GND) 7(3.3V) 9(5V) 10(5V); U13 8(PC14-OSC32_IN) 9(PC15-OSC32_OUT)

## Notes on the sheet
- (near P10) Bank2
- (near P10) Bank4

## Library data of the parts
32_PWR D0-D4 D6 PWLED = LED0: Typical INFRARED GaAs LED; Published: 8-Jun-2000; LatestRevisionDate: 08-Jul-2005; LatestRevisionNote: Mech Layer 1 removed.; PackageReference: LED-0; Publisher: Altium Limited
32_RESET RESET = SW-PB: Switch; Published: 24-Mar-1999; LatestRevisionDate: 17-Jul-2002; LatestRevisionNote: Re-released for DXP Platform.; PackageReference: SPST-2; Publisher: Altium Limited
C1 C2 C5-C67 C69-C74 C77 C80 = Cap: Capacitor; Published: 8-Jun-2000; LatestRevisionDate: 17-Jul-2002; LatestRevisionNote: Re-released for DXP Platform.; PackageReference: RAD-0.3; Publisher: Altium Limited
  C58-C63: PackageDescription: Radial Cap, Thru-Hole; 2 Leads; 0.3 in Pin Spacing
C3 C4 = Cap Pol1: Polarized Capacitor (Radial); Published: 8-Jun-2000; LatestRevisionDate: 17-Jul-2002; LatestRevisionNote: Re-released for DXP Platform.; PackageReference: RB7.6-15; Publisher: Altium Limited
EPCS JTAG = Header 5X2: Header, 5-Pin, Dual row; LatestRevisionDate: 17-Jul-2002; LatestRevisionNote: Re-released for DXP Platform.; Publisher: Altium Limited
L2-L7 = Inductor: Code_IEC: 1005; Published: 8-Jun-2000; LatestRevisionDate: 17-Jul-2002; LatestRevisionNote: Re-released for DXP Platform.; PackageReference: 0402-A; Publisher: Altium Limited; Code_JEITA: 0402
P1 = Header 3: Header, 3-Pin; LatestRevisionDate: 17-Jul-2002; LatestRevisionNote: Re-released for DXP Platform.; Publisher: Altium Limited
P2 U10 = Header 8: Header, 8-Pin; LatestRevisionDate: 17-Jul-2002; LatestRevisionNote: Re-released for DXP Platform.; Publisher: Altium Limited
R1-R4 R6 R7 R9-R25 R32 R33 R36 R38-R46 R48 = Res1: Resistor; Published: 8-Jun-2000; LatestRevisionDate: 17-Jul-2002; LatestRevisionNote: Re-released for DXP Platform.; PackageReference: AXIAL-0.3; Publisher: Altium Limited
SW = SW-SPDT: SPDT Subminiature Toggle Switch, Right Angle Mounting, Vertical Actuation; Published: 24-Mar-1999; LatestRevisionDate: 17-Dec-2003; LatestRevisionNote: Schematic revised, PCB Footprint replaced.; DatasheetDocument: 05-Dec-2000; PackageReference: TL36WW15050; Publisher: Altium Limited; ComponentLink1Description: Manufacturer Link; ComponentLink1URL: http://www.apem.com
U1 U2 U5 X1 X2 = Header 4: Header, 4-Pin; LatestRevisionDate: 17-Jul-2002; LatestRevisionNote: Re-released for DXP Platform.; Publisher: Altium Limited
U4 = EP3C25Q240C8
X4 = XTAL: Crystal Oscillator; pin to pad: 2>3; Published: 8-Jun-2000; LatestRevisionDate: 17-Jul-2002; LatestRevisionNote: Re-released for DXP Platform.; PackageReference: R38; Publisher: Altium Limited; PackageDescription: Crystal, Thru-Hole; 2 Leads; Body 3.1 x 8.2 mm (Dia.xH)